# EAGLE design I2C16RJ45 (EAGLE 9.5.0)

## Sheet 1 of 2
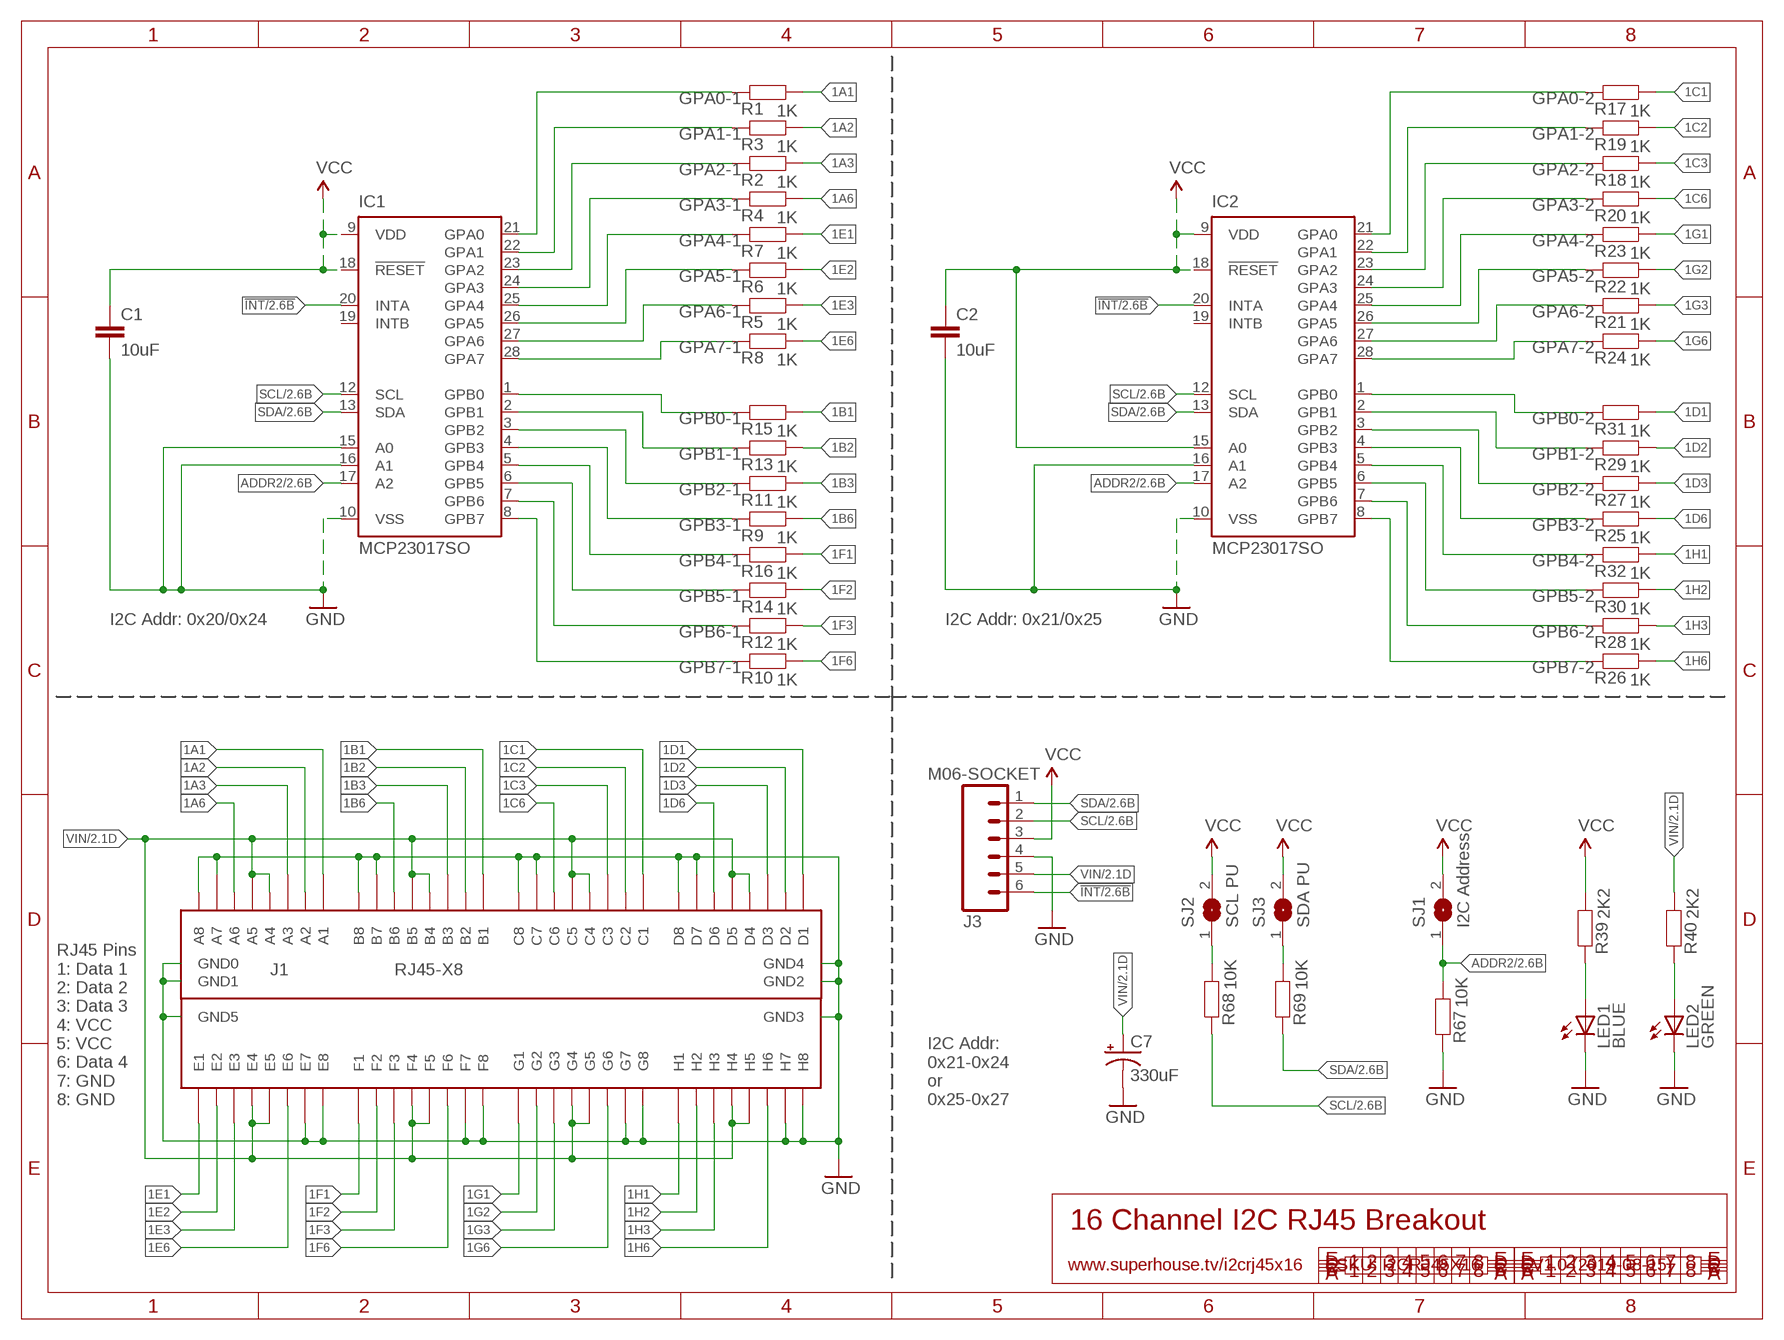
[diagram p0: schematic, sheet 1]

### Parts
C1  10uF  CAP0805  [C0805]
C2  10uF  CAP0805  [C0805]
C7  330uF  CAP_POLG  [PANASONIC_G]
IC1  MCP23017SO  [SO28W]
IC2  MCP23017SO  [SO28W]
J1  RJ45-X8  [RJ45-2X4]
J3  M06-SOCKET  [1X06-S]
LED1  BLUE  LED0603  [LED-0603]
LED2  GREEN  LED0603  [LED-0603]
R1  1K  RESISTOR0603  [R0603]
R2  1K  RESISTOR0603  [R0603]
R3  1K  RESISTOR0603  [R0603]
R4  1K  RESISTOR0603  [R0603]
R5  1K  RESISTOR0603  [R0603]
R6  1K  RESISTOR0603  [R0603]
R7  1K  RESISTOR0603  [R0603]
R8  1K  RESISTOR0603  [R0603]
R9  1K  RESISTOR0603  [R0603]
R10  1K  RESISTOR0603  [R0603]
R11  1K  RESISTOR0603  [R0603]
R12  1K  RESISTOR0603  [R0603]
R13  1K  RESISTOR0603  [R0603]
R14  1K  RESISTOR0603  [R0603]
R15  1K  RESISTOR0603  [R0603]
R16  1K  RESISTOR0603  [R0603]
R17  1K  RESISTOR0603  [R0603]
R18  1K  RESISTOR0603  [R0603]
R19  1K  RESISTOR0603  [R0603]
R20  1K  RESISTOR0603  [R0603]
R21  1K  RESISTOR0603  [R0603]
R22  1K  RESISTOR0603  [R0603]
R23  1K  RESISTOR0603  [R0603]
R24  1K  RESISTOR0603  [R0603]
R25  1K  RESISTOR0603  [R0603]
R26  1K  RESISTOR0603  [R0603]
R27  1K  RESISTOR0603  [R0603]
R28  1K  RESISTOR0603  [R0603]
R29  1K  RESISTOR0603  [R0603]
R30  1K  RESISTOR0603  [R0603]
R31  1K  RESISTOR0603  [R0603]
R32  1K  RESISTOR0603  [R0603]
R39  2K2  RESISTOR0603  [R0603]
R40  2K2  RESISTOR0603  [R0603]
R67  10K  RESISTOR0603  [R0603]
R68  10K  RESISTOR0603  [R0603]
R69  10K  RESISTOR0603  [R0603]
SJ1  I2C Address  SJ-NORMAL  [SJ]
SJ2  SCL PU  SJ-NORMAL  [SJ]
SJ3  SDA PU  SJ-NORMAL  [SJ]

### Nets
1A1: J1.A1 R1.2
1A2: J1.A2 R3.2
1A3: J1.A3 R2.2
1A6: J1.A6 R4.2
1B1: J1.B1 R15.2
1B2: J1.B2 R13.2
1B3: J1.B3 R11.2
1B6: J1.B6 R9.2
1C1: J1.C1 R17.2
1C2: J1.C2 R19.2
1C3: J1.C3 R18.2
1C6: J1.C6 R20.2
1D1: J1.D1 R31.2
1D2: J1.D2 R29.2
1D3: J1.D3 R27.2
1D6: J1.D6 R25.2
1E1: J1.E1 R7.2
1E2: J1.E2 R6.2
1E3: J1.E3 R5.2
1E6: J1.E6 R8.2
1F1: J1.F1 R16.2
1F2: J1.F2 R14.2
1F3: J1.F3 R12.2
1F6: J1.F6 R10.2
1G1: J1.G1 R23.2
1G2: J1.G2 R22.2
1G3: J1.G3 R21.2
1G6: J1.G6 R24.2
1H1: J1.H1 R32.2
1H2: J1.H2 R30.2
1H3: J1.H3 R28.2
1H6: J1.H6 R26.2
!INT: IC1.20(INTA) IC2.20(INTA) J3.6 ; also sheet 2
ADDR2: IC1.17(A2) IC2.17(A2) R67.2 SJ1.1 ; also sheet 2
GND: C1.2 C2.2 C7.- IC1.10(VSS) IC1.15(A0) IC1.16(A1) IC2.10(VSS) IC2.16(A1) J1.A7 J1.A8 J1.B7 J1.B8 J1.C7 J1.C8 J1.D7 J1.D8 J1.E7 J1.E8 J1.F7 J1.F8 J1.G7 J1.G8 J1.GND0 J1.GND1 J1.GND2 J1.GND3 J1.GND4 J1.GND5 J1.H7 J1.H8 J3.4 LED1.C LED2.C R67.1 ; also sheet 2
GPA0-1: IC1.21(GPA0) R1.1
GPA0-2: IC2.21(GPA0) R17.1
GPA1-1: IC1.22(GPA1) R3.1
GPA1-2: IC2.22(GPA1) R19.1
GPA2-1: IC1.23(GPA2) R2.1
GPA2-2: IC2.23(GPA2) R18.1
GPA3-1: IC1.24(GPA3) R4.1
GPA3-2: IC2.24(GPA3) R20.1
GPA4-1: IC1.25(GPA4) R7.1
GPA4-2: IC2.25(GPA4) R23.1
GPA5-1: IC1.26(GPA5) R6.1
GPA5-2: IC2.26(GPA5) R22.1
GPA6-1: IC1.27(GPA6) R5.1
GPA6-2: IC2.27(GPA6) R21.1
GPA7-1: IC1.28(GPA7) R8.1
GPA7-2: IC2.28(GPA7) R24.1
GPB0-1: IC1.1(GPB0) R15.1
GPB0-2: IC2.1(GPB0) R31.1
GPB1-1: IC1.2(GPB1) R13.1
GPB1-2: IC2.2(GPB1) R29.1
GPB2-1: IC1.3(GPB2) R11.1
GPB2-2: IC2.3(GPB2) R27.1
GPB3-1: IC1.4(GPB3) R9.1
GPB3-2: IC2.4(GPB3) R25.1
GPB4-1: IC1.5(GPB4) R16.1
GPB4-2: IC2.5(GPB4) R32.1
GPB5-1: IC1.6(GPB5) R14.1
GPB5-2: IC2.6(GPB5) R30.1
GPB6-1: IC1.7(GPB6) R12.1
GPB6-2: IC2.7(GPB6) R28.1
GPB7-1: IC1.8(GPB7) R10.1
GPB7-2: IC2.8(GPB7) R26.1
N$1: R68.2 SJ2.1
N$2: R69.2 SJ3.1
N$7: LED1.A R39.1
N$8: LED2.A R40.1
SCL: IC1.12(SCL) IC2.12(SCL) J3.2 R68.1 ; also sheet 2
SDA: IC1.13(SDA) IC2.13(SDA) J3.1 R69.1 ; also sheet 2
VCC: C1.1 C2.1 IC1.9(VDD) IC1.18(!RESET) IC2.9(VDD) IC2.15(A0) IC2.18(!RESET) J3.3 R39.2 SJ1.2 SJ2.2 SJ3.2 ; also sheet 2
VIN: C7.+ J1.A4 J1.A5 J1.B4 J1.B5 J1.C4 J1.C5 J1.D4 J1.D5 J1.E4 J1.E5 J1.F4 J1.F5 J1.G4 J1.G5 J1.H4 J1.H5 J3.5 R40.2 ; also sheet 2
Unconnected: IC1.19(INTB) IC2.19(INTB)

### Notes on the sheet
- I2C Addr: 0x20/0x24 | I2C Addr: 0x21/0x25
- RJ45 Pins
  1: Data 1
  2: Data 2
  3: Data 3
  4: VCC
  5: VCC
  6: Data 4
  7: GND
  8: GND
- I2C Addr:
  0x21-0x24
  or
  0x25-0x27
- 16 Channel I2C RJ45 Breakout
- www.superhouse.tv/i2crj45x16 | SKU: I2CRJ45X16 | V1.0 (2019-08-15)

## Sheet 2 of 2
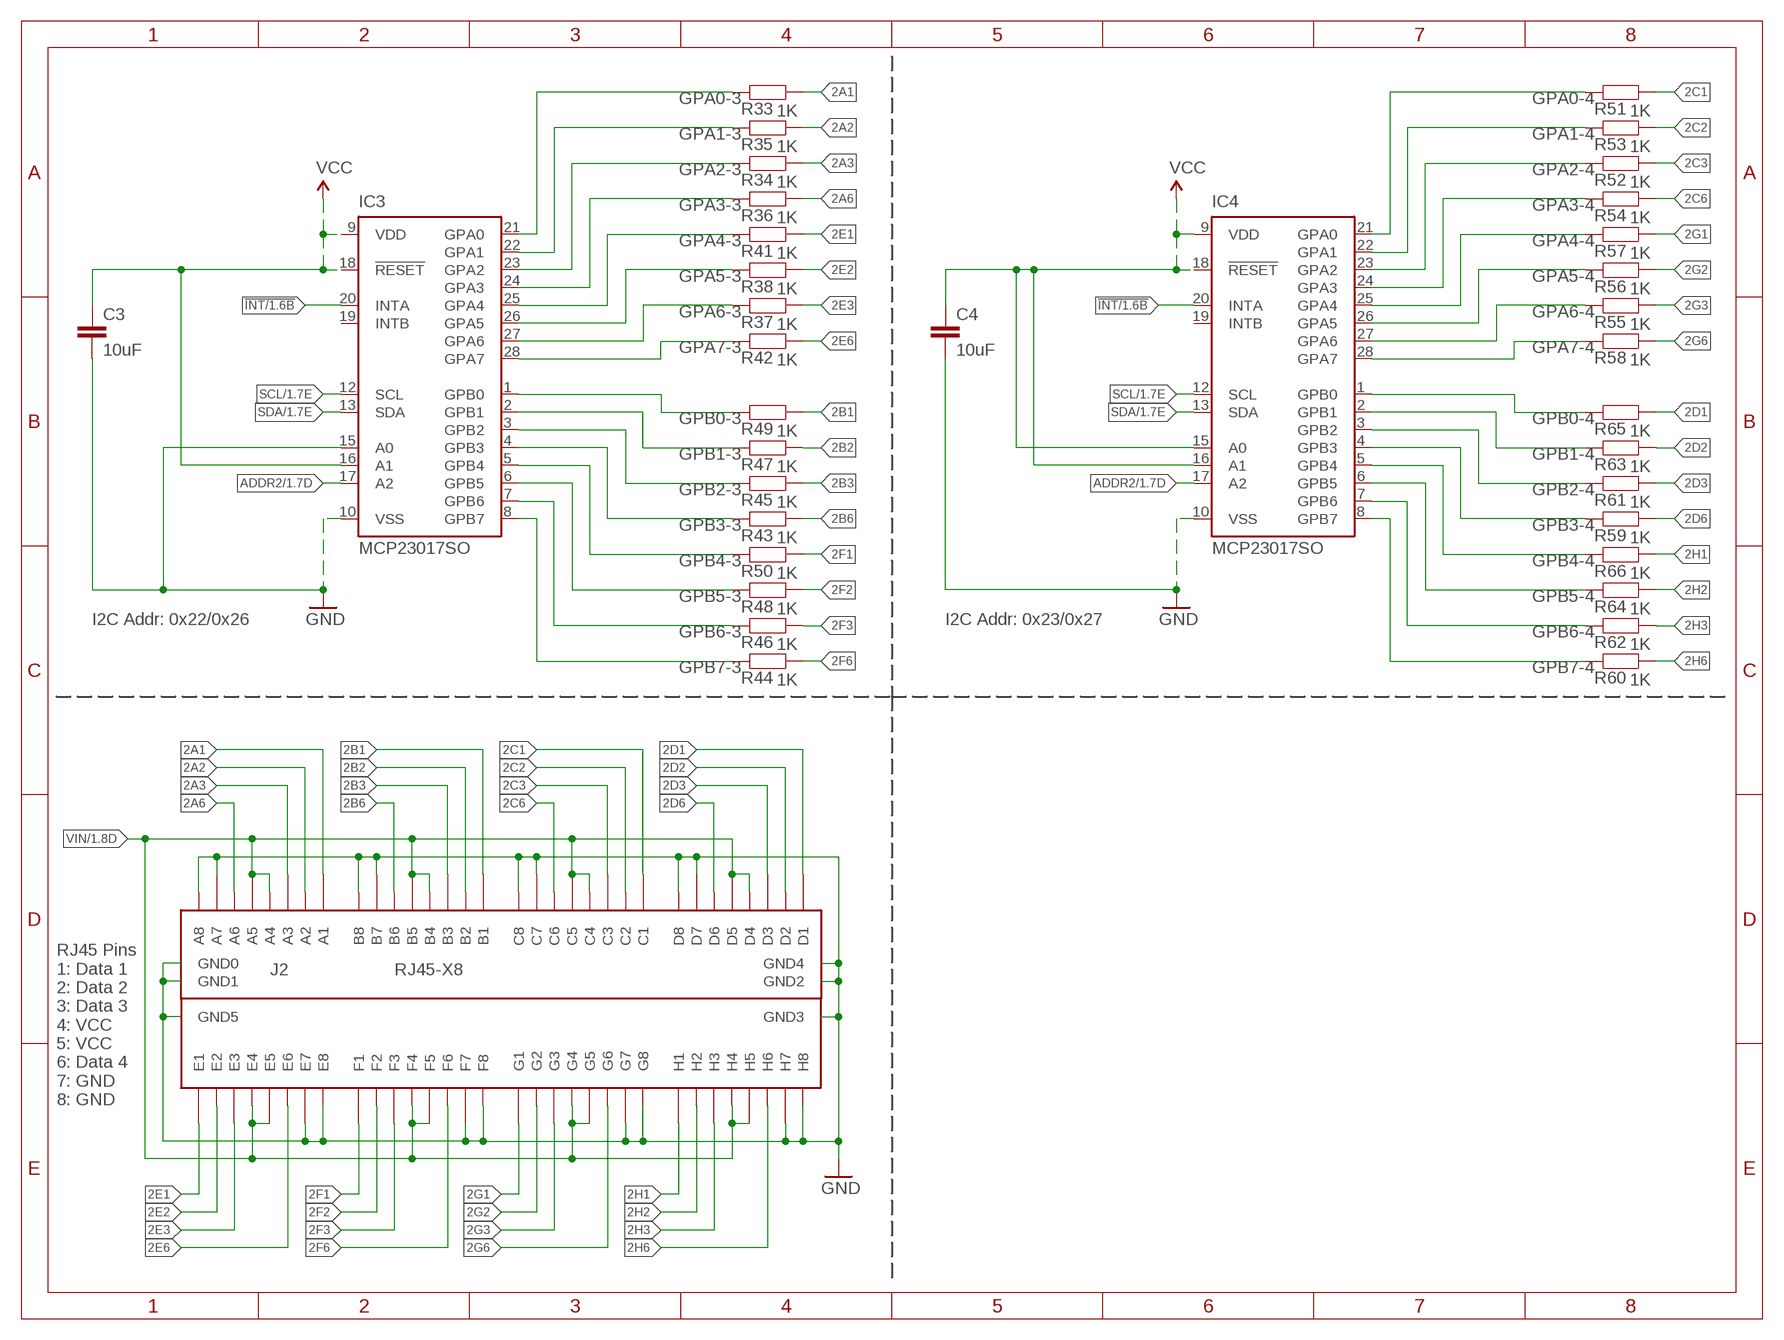
[diagram p1: schematic, sheet 2]

### Parts
C3  10uF  CAP0805  [C0805]
C4  10uF  CAP0805  [C0805]
IC3  MCP23017SO  [SO28W]
IC4  MCP23017SO  [SO28W]
J2  RJ45-X8  [RJ45-2X4]
R33  1K  RESISTOR0603  [R0603]
R34  1K  RESISTOR0603  [R0603]
R35  1K  RESISTOR0603  [R0603]
R36  1K  RESISTOR0603  [R0603]
R37  1K  RESISTOR0603  [R0603]
R38  1K  RESISTOR0603  [R0603]
R41  1K  RESISTOR0603  [R0603]
R42  1K  RESISTOR0603  [R0603]
R43  1K  RESISTOR0603  [R0603]
R44  1K  RESISTOR0603  [R0603]
R45  1K  RESISTOR0603  [R0603]
R46  1K  RESISTOR0603  [R0603]
R47  1K  RESISTOR0603  [R0603]
R48  1K  RESISTOR0603  [R0603]
R49  1K  RESISTOR0603  [R0603]
R50  1K  RESISTOR0603  [R0603]
R51  1K  RESISTOR0603  [R0603]
R52  1K  RESISTOR0603  [R0603]
R53  1K  RESISTOR0603  [R0603]
R54  1K  RESISTOR0603  [R0603]
R55  1K  RESISTOR0603  [R0603]
R56  1K  RESISTOR0603  [R0603]
R57  1K  RESISTOR0603  [R0603]
R58  1K  RESISTOR0603  [R0603]
R59  1K  RESISTOR0603  [R0603]
R60  1K  RESISTOR0603  [R0603]
R61  1K  RESISTOR0603  [R0603]
R62  1K  RESISTOR0603  [R0603]
R63  1K  RESISTOR0603  [R0603]
R64  1K  RESISTOR0603  [R0603]
R65  1K  RESISTOR0603  [R0603]
R66  1K  RESISTOR0603  [R0603]

### Nets
2A1: J2.A1 R33.2
2A2: J2.A2 R35.2
2A3: J2.A3 R34.2
2A6: J2.A6 R36.2
2B1: J2.B1 R49.2
2B2: J2.B2 R47.2
2B3: J2.B3 R45.2
2B6: J2.B6 R43.2
2C1: J2.C1 R51.2
2C2: J2.C2 R53.2
2C3: J2.C3 R52.2
2C6: J2.C6 R54.2
2D1: J2.D1 R65.2
2D2: J2.D2 R63.2
2D3: J2.D3 R61.2
2D6: J2.D6 R59.2
2E1: J2.E1 R41.2
2E2: J2.E2 R38.2
2E3: J2.E3 R37.2
2E6: J2.E6 R42.2
2F1: J2.F1 R50.2
2F2: J2.F2 R48.2
2F3: J2.F3 R46.2
2F6: J2.F6 R44.2
2G1: J2.G1 R57.2
2G2: J2.G2 R56.2
2G3: J2.G3 R55.2
2G6: J2.G6 R58.2
2H1: J2.H1 R66.2
2H2: J2.H2 R64.2
2H3: J2.H3 R62.2
2H6: J2.H6 R60.2
!INT: IC3.20(INTA) IC4.20(INTA) ; also sheet 1
ADDR2: IC3.17(A2) IC4.17(A2) ; also sheet 1
GND: C3.2 C4.2 IC3.10(VSS) IC3.15(A0) IC4.10(VSS) J2.A7 J2.A8 J2.B7 J2.B8 J2.C7 J2.C8 J2.D7 J2.D8 J2.E7 J2.E8 J2.F7 J2.F8 J2.G7 J2.G8 J2.GND0 J2.GND1 J2.GND2 J2.GND3 J2.GND4 J2.GND5 J2.H7 J2.H8 ; also sheet 1
GPA0-3: IC3.21(GPA0) R33.1
GPA0-4: IC4.21(GPA0) R51.1
GPA1-3: IC3.22(GPA1) R35.1
GPA1-4: IC4.22(GPA1) R53.1
GPA2-3: IC3.23(GPA2) R34.1
GPA2-4: IC4.23(GPA2) R52.1
GPA3-3: IC3.24(GPA3) R36.1
GPA3-4: IC4.24(GPA3) R54.1
GPA4-3: IC3.25(GPA4) R41.1
GPA4-4: IC4.25(GPA4) R57.1
GPA5-3: IC3.26(GPA5) R38.1
GPA5-4: IC4.26(GPA5) R56.1
GPA6-3: IC3.27(GPA6) R37.1
GPA6-4: IC4.27(GPA6) R55.1
GPA7-3: IC3.28(GPA7) R42.1
GPA7-4: IC4.28(GPA7) R58.1
GPB0-3: IC3.1(GPB0) R49.1
GPB0-4: IC4.1(GPB0) R65.1
GPB1-3: IC3.2(GPB1) R47.1
GPB1-4: IC4.2(GPB1) R63.1
GPB2-3: IC3.3(GPB2) R45.1
GPB2-4: IC4.3(GPB2) R61.1
GPB3-3: IC3.4(GPB3) R43.1
GPB3-4: IC4.4(GPB3) R59.1
GPB4-3: IC3.5(GPB4) R50.1
GPB4-4: IC4.5(GPB4) R66.1
GPB5-3: IC3.6(GPB5) R48.1
GPB5-4: IC4.6(GPB5) R64.1
GPB6-3: IC3.7(GPB6) R46.1
GPB6-4: IC4.7(GPB6) R62.1
GPB7-3: IC3.8(GPB7) R44.1
GPB7-4: IC4.8(GPB7) R60.1
SCL: IC3.12(SCL) IC4.12(SCL) ; also sheet 1
SDA: IC3.13(SDA) IC4.13(SDA) ; also sheet 1
VCC: C3.1 C4.1 IC3.9(VDD) IC3.16(A1) IC3.18(!RESET) IC4.9(VDD) IC4.15(A0) IC4.16(A1) IC4.18(!RESET) ; also sheet 1
VIN: J2.A4 J2.A5 J2.B4 J2.B5 J2.C4 J2.C5 J2.D4 J2.D5 J2.E4 J2.E5 J2.F4 J2.F5 J2.G4 J2.G5 J2.H4 J2.H5 ; also sheet 1
Unconnected: IC3.19(INTB) IC4.19(INTB)

### Notes on the sheet
- I2C Addr: 0x22/0x26 | I2C Addr: 0x23/0x27
- RJ45 Pins
  1: Data 1
  2: Data 2
  3: Data 3
  4: VCC
  5: VCC
  6: Data 4
  7: GND
  8: GND

## Library data of the parts
C1-C4 = SuperHouse-DiscreteSemi:CAP: Capacitor Standard ceramic capacitor
C7 = SuperHouse-DiscreteSemi:CAP_POL: Capacitor Polarized These are standard SMD and PTH capacitors. Normally 10uF, 47uF, and 100uF in electrolytic and tantalum varieties. Always verify the external diameter of the through hole cap, it varies with capacity, voltage, and manufacturer. The EIA devices should be standard.
IC1-IC4 = SuperHouse-ICs:MCP23017: http://ww1.microchip.com/downloads/en/DeviceDoc/21952a.pdf Source: http://ww1.microchip.com/downloads/en/DeviceDoc/21952a.pdf
J1 J2 = SuperHouse-Connectors:RJ45-X8: 8-way RJ45 socket, PCB mount. 2 rows of 4.
J3 = SuperHouse-Connectors:M06: 6-way header Standard 1x6 header, and screw terminal variations
LED1 LED2 = SuperHouse-LEDs:LED: LEDs Standard schematic elements and footprints for 5mm, 3mm, 1206, and 0603 sized LEDs. 5mm - Spark Fun Electronics SKU : COM-00529 (and others)
R1-R69 = SuperHouse-DiscreteSemi:RESISTOR: Resistor Standard resistors.
SJ1-SJ3 = SuperHouse-Jumpers:SJ: SMD solder jumper, normally-open. Add solder to close the connection.

## Board
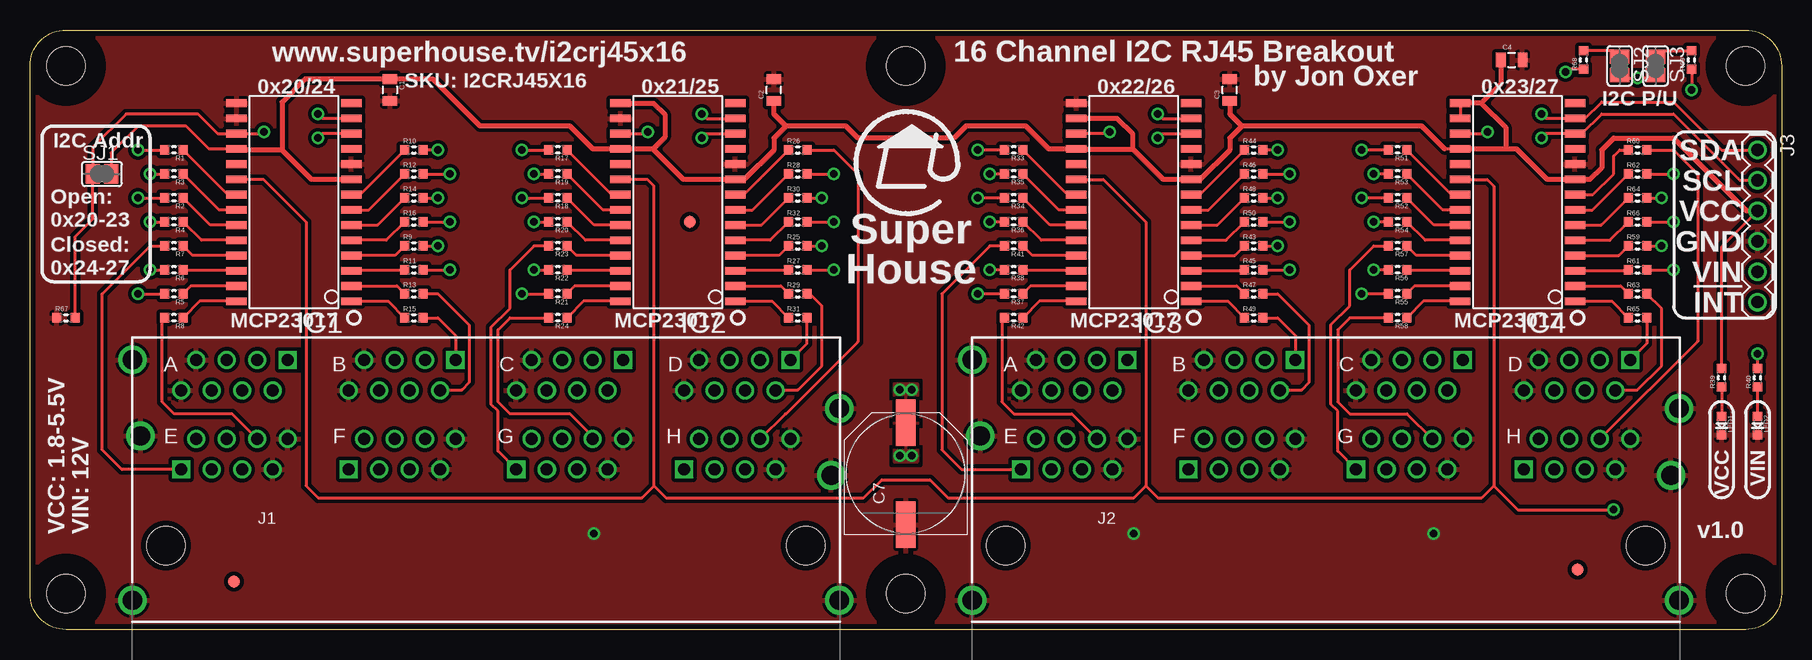
[diagram p2: board, top side]
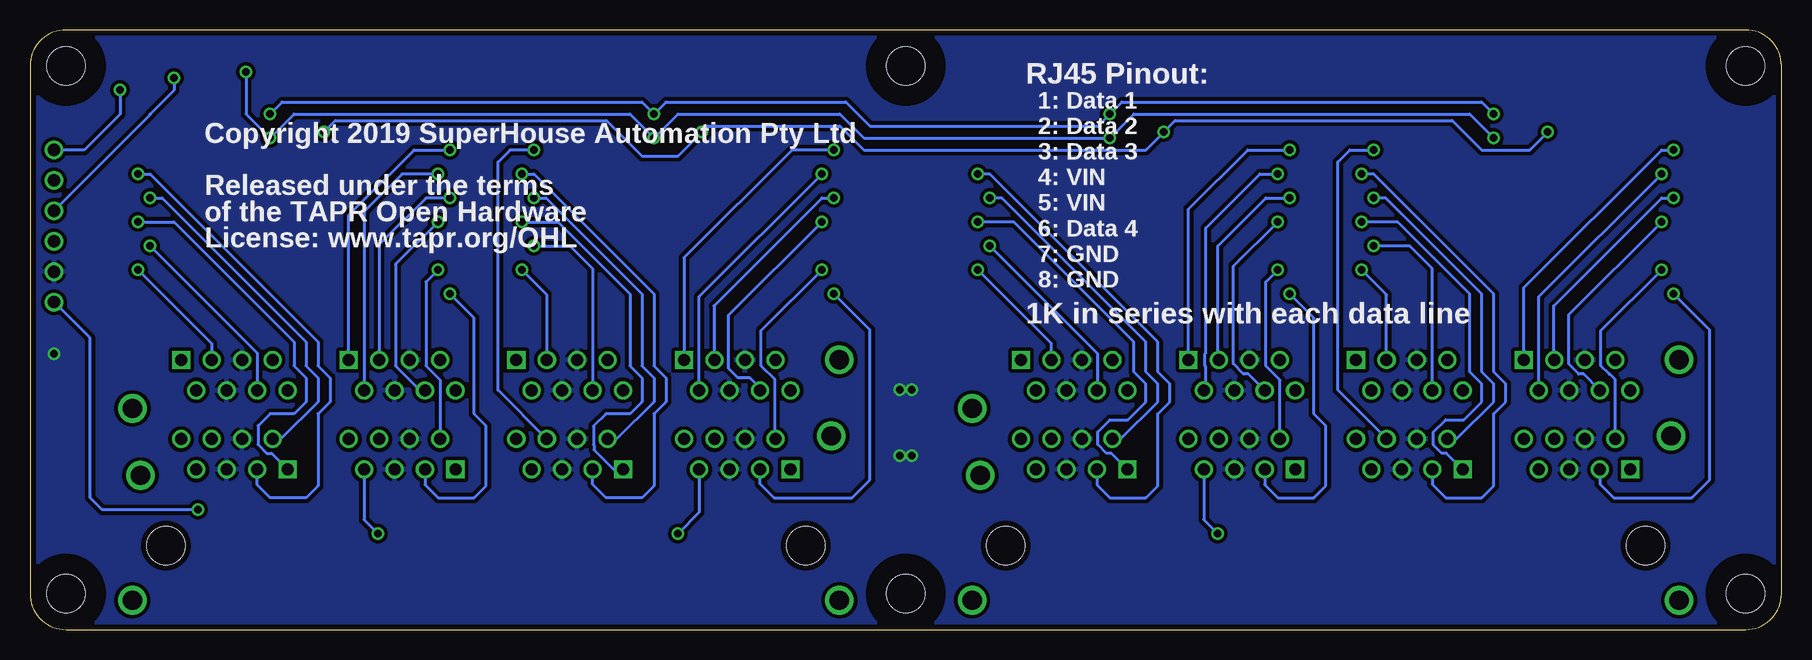
[diagram p3: board, bottom side, seen from below]

Size 146 x 50 mm. Coordinates in mm from the lower left corner, seen from the top.
Outline: 3,0 arc-90 0,3 0,47 arc-90 3,50 143,50 arc-90 146,47 146,3 arc-90 143,0 3,0
Copper layers (1*16): Top 0.035mm / dielectric 1.5mm / Bottom 0.035mm
Design rules "default *": minimum track width 10mil, minimum drill 24mil, track to track 12mil, track to pad 12mil, pad to pad 12mil, via to via 12mil, smd to smd 8mil, copper to edge 18mil, drill to drill 8mil, minimum pad ring 10mil, minimum via ring 8mil, stop-mask expansion 4mil, vias tented up to drill 0mil, thermal gap 10mil
Holes 3.2 mm at 3,3 143,3 143,47 3,47 73,3 73,47
tRestrict: area -0.2,43.8 to 6.2,50.2; area -0.2,-0.2 to 6.2,6.2; area 69.8,-0.2 to 76.2,6.2; area 139.8,-0.2 to 146.2,6.2; area 139.8,43.8 to 146.2,50.2; area 69.8,43.8 to 76.2,50.2
bRestrict: area -0.2,43.8 to 6.2,50.2; area 69.8,43.8 to 76.2,50.2; area 139.8,43.8 to 146.2,50.2; area 69.8,-0.2 to 76.2,6.2; area 139.8,-0.2 to 146.2,6.2; area -0.2,-0.2 to 6.2,6.2

### Footprints (pad centres in the part's own frame; a part is rotated, then mirrored left to right if it is on the bottom)
C0805 = smd 0.8 x 1.2: 1 -0.9,0; 2 0.9,0
PANASONIC_G = smd 3.9 x 1.6: + 4.25,0; - -4.25,0
FIDUCIAL-1X2.5 = smd 1 x 1: 1 0,0
SO28W = smd 0.65 x 1.7: 1 -7.62,-4.78; 2 -6.35,-4.78; 3 -5.08,-4.78; 4 -3.81,-4.78; 5 -2.54,-4.78; 6 -1.27,-4.78; 7 0,-4.78; 8 1.27,-4.78; 9 2.54,-4.78; 10 3.81,-4.78; 11 5.08,-4.78; 12 6.35,-4.78; 13 7.62,-4.78; 14 8.89,-4.78; 15 8.89,4.78; 16 7.62,4.78; 17 6.35,4.78; 18 5.08,4.78; 19 3.81,4.78; 20 2.54,4.78; 21 1.27,4.78; 22 0,4.78; 23 -1.27,4.78; 24 -2.54,4.78; 25 -3.81,4.78; 26 -5.08,4.78; 27 -6.35,4.78; 28 -7.62,4.78
RJ45-2X4 = drill 1 square: A1 -16.51,15.49; B1 -2.54,15.49; C1 11.43,15.49; D1 25.4,15.49; E1 -25.4,6.35; F1 -11.43,6.35; G1 2.54,6.35; H1 16.51,6.35 | drill 1: A2 -17.78,12.95; A3 -19.05,15.49; A4 -20.32,12.95; A5 -21.59,15.49; A6 -22.86,12.95; A7 -24.13,15.49; A8 -25.4,12.95; B2 -3.81,12.95; B3 -5.08,15.49; B4 -6.35,12.95; B5 -7.62,15.49; B6 -8.89,12.95; B7 -10.16,15.49; B8 -11.43,12.95; C2 10.16,12.95; C3 8.89,15.49; C4 7.62,12.95; C5 6.35,15.49; C6 5.08,12.95; C7 3.81,15.49; C8 2.54,12.95; D2 24.13,12.95; D3 22.86,15.49; D4 21.59,12.95; D5 20.32,15.49; D6 19.05,12.95; D7 17.78,15.49; D8 16.51,12.95; E2 -24.13,8.89; E3 -22.86,6.35; E4 -21.59,8.89; E5 -20.32,6.35; E6 -19.05,8.89; E7 -17.78,6.35; E8 -16.51,8.89; F2 -10.16,8.89; F3 -8.89,6.35; F4 -7.62,8.89; F5 -6.35,6.35; F6 -5.08,8.89; F7 -3.81,6.35; F8 -2.54,8.89; G2 3.81,8.89; G3 5.08,6.35; G4 6.35,8.89; G5 7.62,6.35; G6 8.89,8.89; G7 10.16,6.35; G8 11.43,8.89; H2 17.78,8.89; H3 19.05,6.35; H4 20.32,8.89; H5 21.59,6.35; H6 22.86,8.89; H7 24.13,6.35; H8 25.4,8.89 | drill 1.6: GND0 29.464,-4.572; GND1 28.79,5.85; GND2 -29.46,15.5; GND3 -28.79,9.15; GND4 -29.464,-4.572; GND5 29.46,11.43 | hole 3.2: 26.67,0; -26.67,0
1X06-S = drill 1.016: 1 0,0; 2 2.54,0; 3 5.08,0; 4 7.62,0; 5 10.16,0; 6 12.7,0
LED-0603 = smd 0.762 x 0.762: A -0.762,0; C 0.762,0
R0603 = smd 0.762 x 0.762: 1 -0.762,0; 2 0.762,0
SJ = smd 1.168 x 1.6: 1 -0.762,0; 2 0.762,0

### Placement (x,y rotation side)
C1  30,45 270 top
C2  62,45 90 top
C3  100,45 90 top
C4  123.5,47.5 0 top
C7  73,13 90 top
FID1  FIDUCIAL1X2.5  [FIDUCIAL-1X2.5]  129,5 0 top
FID2  FIDUCIAL1X2.5  [FIDUCIAL-1X2.5]  17,4 0 top
FID3  FIDUCIAL1X2.5  [FIDUCIAL-1X2.5]  55,34 0 top
IC1  22,35 90 top
IC2  54,35 90 top
IC3  92,35 90 top
IC4  124,35 90 top
J1  38,7 0 top
J2  108,7 0 top
J3  144,40 270 top
LED1  141,17 270 top
LED2  144,17 270 top
R1  12,40 180 top
R2  12,36 180 top
R3  12,38 180 top
R4  12,34 180 top
R5  12,28 180 top
R6  12,30 180 top
R7  12,32 180 top
R8  12,26 180 top
R9  32,32 0 top
R10  32,40 0 top
R11  32,30 0 top
R12  32,38 0 top
R13  32,28 0 top
R14  32,36 0 top
R15  32,26 0 top
R16  32,34 0 top
R17  44,40 180 top
R18  44,36 180 top
R19  44,38 180 top
R20  44,34 180 top
R21  44,28 180 top
R22  44,30 180 top
R23  44,32 180 top
R24  44,26 180 top
R25  64,32 0 top
R26  64,40 0 top
R27  64,30 0 top
R28  64,38 0 top
R29  64,28 0 top
R30  64,36 0 top
R31  64,26 0 top
R32  64,34 0 top
R33  82,40 180 top
R34  82,36 180 top
R35  82,38 180 top
R36  82,34 180 top
R37  82,28 180 top
R38  82,30 180 top
R39  141,21 90 top
R40  144,21 90 top
R41  82,32 180 top
R42  82,26 180 top
R43  102,32 0 top
R44  102,40 0 top
R45  102,30 0 top
R46  102,38 0 top
R47  102,28 0 top
R48  102,36 0 top
R49  102,26 0 top
R50  102,34 0 top
R51  114,40 180 top
R52  114,36 180 top
R53  114,38 180 top
R54  114,34 180 top
R55  114,28 180 top
R56  114,30 180 top
R57  114,32 180 top
R58  114,26 180 top
R59  134,32 0 top
R60  134,40 0 top
R61  134,30 0 top
R62  134,38 0 top
R63  134,28 0 top
R64  134,36 0 top
R65  134,26 0 top
R66  134,34 0 top
R67  3,26 0 top
R68  129.5,47.5 90 top
R69  138.5,47.5 90 top
SJ1  6,38 0 top
SJ2  132.5,47 270 top
SJ3  135.5,47 270 top

### Tracks (layer width: path | path; a pad name or v marks a point on that pad's centre or on a via)
1A1  (via drill 0.61)
  Top 0.254: v9,40 R1.2
  Bottom 0.254: J1.A1 21.49,28.51 10,40 v9,40
1A2  (via drill 0.61)
  Top 0.254: v10,38 R3.2
  Bottom 0.254: J1.A2 20.22,27.78 v10,38
1A3  (via drill 0.61)
  Top 0.254: v9,36 R2.2
  Bottom 0.254: J1.A3 19,22.54 19,27 10,36 v9,36
1A6  (via drill 0.61)
  Top 0.254: v10,34 R4.2
  Bottom 0.254: J1.A6 16.49,21.3 16.9,21.3 17.76,22.17 17.76,26.24 v10,34
1B1
  Top 0.254: R15.2 34,26 35.46,24.54 J1.B1
1B2
  Top 0.254: J1.B2 34.24,20 36,20 36.65,20.65 36.65,25.35 34,28 R13.2
1B3  (via drill 0.61)
  Top 0.254: R11.2 v35,30
  Bottom 0.254: J1.B3 32.92,27.92 v35,30
1B6  (via drill 0.61)
  Top 0.254: R9.2 v34,32
  Bottom 0.254: J1.B6 29.11,30.11 31,32 v34,32
1C1  (via drill 0.61)
  Top 0.254: v41,40 R17.2
  Bottom 0.254: J1.C1 49.43,35.07 44.5,40 v41,40
1C2  (via drill 0.61)
  Top 0.254: v42,38 R19.2
  Bottom 0.254: J1.C2 48,20.11 48,21.92 48.08,22 48.08,22.98 48,23.06 48,33.5 43.5,38 v42,38
1C3  (via drill 0.61)
  Top 0.254: v41,36 R18.2
  Bottom 0.254: J1.C3 47,22.6 47,32 43,36 v41,36
1C6  (via drill 0.61)
  Top 0.254: v42,34 R20.2
  Bottom 0.254: J1.C6 44.43,21.3 44.84,21.3 45.7,22.17 45.7,30.3 v42,34
1D1
  Top 0.254: J1.D1 64.76,23.85 R31.2
1D2
  Top 0.254: J1.D2 62.18,20 64,20 66,22 66,27 65,28 R29.2
1D3  (via drill 0.61)
  Top 0.254: R27.2 v67,30
  Bottom 0.254: J1.D3 60.86,23.86 v67,30
1D6  (via drill 0.61)
  Top 0.254: R25.2 v66,32
  Bottom 0.254: J1.D6 57,20 57,23 v66,32
1E1
  Top 0.254: J1.E1 7.65,13.35 6,15 6,28 10,32 R7.2
1E2  (via drill 0.61)
  Top 0.254: v10,30 R6.2
  Bottom 0.254: J1.E2 13.87,20.87 14.3,21.3 14.36,21.3 15.06,22 15.06,24.94 v10,30
1E3  (via drill 0.61)
  Top 0.254: v9,28 R5.2
  Bottom 0.254: J1.E3 15.14,12.14 14,11 7.5,11 6,12.5 6,25 v9,28
1E6
  Top 0.254: J1.E6 16.84,18 12,18 11,19 11,25.76 R8.2
1F1  (via drill 0.61)
  Top 0.254: R16.2 v35,34
  Bottom 0.254: J1.F1 27.92,14.7 28.33,14.7 29.03,15.4 29.03,16.47 28,17.5 26.5,17.5 25,19 25,20.5 26,21.5 26,28 32,34 v35,34
1F2  (via drill 0.61)
  Top 0.254: R14.2 v34,36
  Bottom 0.254: J1.F2 27.11,15.89 24,19 24,20.5 25,21.5 25,28 33,36 v34,36
1F3  (via drill 0.61)
  Top 0.254: R12.2 v35,38
  Bottom 0.254: J1.F3 29.11,12.11 28,11 25,11 24,12 24,18 23,19 23,20.5 24,21.5 24,28 34,38 v35,38
1F6  (via drill 0.61)
  Top 0.254: v34,40 R10.2
  Bottom 0.254: J1.F6 32.92,15.92 37,20 37,39 36,40 v34,40
1G1
  Top 0.254: R23.2 42,32 40,30 40,26.79 38.44,25.23 38.44,18.77 39,18.21 39,14.89 J1.G1
1G2  (via drill 0.61)
  Top 0.254: v42,30 R22.2
  Bottom 0.254: J1.G2 41.81,20.81 43,22 43,29 v42,30
1G3  (via drill 0.61)
  Top 0.254: v41,28 R21.2
  Bottom 0.254: J1.G3 43.08,12.08 42,11 39,11 38,12 38,17 39,18 39,26 v41,28
1G6
  Top 0.254: J1.G6 46.89,16.11 45,18 40,18 39,19 39,25 40,26 R24.2
1H1  (via drill 0.61)
  Top 0.254: R32.2 v67,34
  Bottom 0.254: J1.H1 55.86,14.7 56.27,14.7 57,15.43 57,16.5 56,17.5 54.5,17.5 53,19 53,20.5 54,21.5 54,24 64,34 v67,34
1H2  (via drill 0.61)
  Top 0.254: R30.2 v66,36
  Bottom 0.254: J1.H2 55.11,15.89 52,19 52,20.5 53,21.5 53,24 65,36 v66,36
1H3  (via drill 0.61)
  Top 0.254: R28.2 v67,38
  Bottom 0.254: J1.H3 57.05,12.05 56,11 53,11 52,12 52,18 51,19 51,20.5 52,21.5 52,24 66,38 v67,38
1H6
  Top 0.254: J1.H6 62.97,18 63,18 69,24 69,38 67,40 R26.2
2A1  (via drill 0.61)
  Top 0.254: R33.2 v79,40
  Bottom 0.254: v79,40 82.5,40 91.49,31.01 J2.A1
2A2  (via drill 0.61)
  Top 0.254: R35.2 v80,38
  Bottom 0.254: J2.A2 90.22,27.78 v80,38
2A3  (via drill 0.61)
  Top 0.254: R34.2 v79,36
  Bottom 0.254: J2.A3 88.95,26.95 89,27 80,36 v79,36
2A6  (via drill 0.61)
  Top 0.254: R36.2 v80,34
  Bottom 0.254: J2.A6 85.14,20.14 86,21 87,21 87.76,21.76 87.76,26.24 v80,34
2B1
  Top 0.254: R49.2 104,26 105.46,24.54 J2.B1
2B2
  Top 0.254: J2.B2 104.24,20 106,20 106.65,20.65 106.65,25.35 104,28 R47.2
2B3  (via drill 0.61)
  Top 0.254: R45.2 v105,30
  Bottom 0.254: v105,30 102.92,27.92 J2.B3
2B6  (via drill 0.61)
  Top 0.254: R43.2 v104,32
  Bottom 0.254: v104,32 101,32 99.11,30.11 J2.B6
2C1  (via drill 0.61)
  Top 0.254: R51.2 v111,40
  Bottom 0.254: J2.C1 119.43,34.57 114,40 v111,40
2C2  (via drill 0.61)
  Top 0.254: R53.2 v112,38
  Bottom 0.254: v112,38 115,38 118.16,34.84 J2.C2
2C3  (via drill 0.61)
  Top 0.254: R52.2 v111,36
  Bottom 0.254: v111,36 113,36 116.89,32.11 J2.C3
2C6  (via drill 0.61)
  Top 0.254: R54.2 v112,34
  Bottom 0.254: J2.C6 113.49,19.95 115.54,22 115.54,30.46 v112,34
2D1
  Top 0.254: R65.2 134.76,23.85 J2.D1
2D2
  Top 0.254: J2.D2 133.95,19.95 136,22 136,26.76 R63.2
2D3  (via drill 0.61)
  Top 0.254: R61.2 v137,30
  Bottom 0.254: v137,30 130.86,23.86 J2.D3
2D6  (via drill 0.61)
  Top 0.254: R59.2 v136,32
  Bottom 0.254: v136,32 127.05,23.05 J2.D6
2E1
  Top 0.254: R41.2 80,32 76,28 76,15 77.65,13.35 J2.E1
2E2  (via drill 0.61)
  Top 0.254: R38.2 v80,30
  Bottom 0.254: v80,30 85.06,24.94 85.06,22 83.95,20.9 83.95,15.97 J2.E2
2E3  (via drill 0.61)
  Top 0.254: R37.2 v79,28
  Bottom 0.254: J2.E3 85.14,12.14 84,11 77.5,11 76,12.5 76,25 v79,28
2E6
  Top 0.254: R42.2 81,25.76 81,19 82,18 86.84,18 J2.E6
2F1  (via drill 0.61)
  Top 0.254: R50.2 v105,34
  Bottom 0.254: J2.F1 97.35,13.35 99,15 99,15.37 99.03,15.4 99.03,16.97 98,18 96,18 95,19 95,21 96,22 96,28 102,34 v105,34
2F2  (via drill 0.61)
  Top 0.254: R48.2 v104,36
  Bottom 0.254: v104,36 103,36 95,28 95,22 94,21 94,19 97.11,15.89 J2.F2
2F3  (via drill 0.61)
  Top 0.254: R46.2 v105,38
  Bottom 0.254: v105,38 104,38 94,28 94,22 93,21 93,19 94,18 94,12 95,11 98,11 99.11,12.11 J2.F3
2F6  (via drill 0.61)
  Top 0.254: v104,40 R44.2
  Bottom 0.254: v104,40 106,40 107,39 107,19.97 J2.F6
2G1
  Top 0.254: J2.G1 109,14.89 109,18.21 108.44,18.77 108.44,25.44 110,27 110,30 112,32 R57.2
2G2  (via drill 0.61)
  Top 0.254: R56.2 v112,30
  Bottom 0.254: v112,30 113,29 113,22 111.81,20.81 J2.G2
2G3  (via drill 0.61)
  Top 0.254: R55.2 v111,28
  Bottom 0.254: J2.G3 113.08,12.08 112,11 109,11 108,12 108,17 109,18 109,26 v111,28
2G6
  Top 0.254: R58.2 110,26 109,25 109,19 110,18 114.78,18 J2.G6
2H1  (via drill 0.61)
  Top 0.254: R66.2 v137,34
  Bottom 0.254: v137,34 134,34 124,24 124,22 123,21 123,19 124,18 126,18 127,17 127,15.43 126.27,14.7 125.86,14.7 J2.H1
2H2  (via drill 0.61)
  Top 0.254: R64.2 v136,36
  Bottom 0.254: v136,36 135,36 123,24 123,22 122,21 122,19 125.11,15.89 J2.H2
2H3  (via drill 0.61)
  Top 0.254: R62.2 v137,38
  Bottom 0.254: v137,38 136,38 122,24 122,22 121,21 121,19 122,18 122,12 123,11 126,11 127.05,12.05 J2.H3
2H6
  Top 0.254: R60.2 137,40 139,38 139,24.03 J2.H6
!INT  (via drill 0.61)
  Top 0.254: IC1.20 19.46,37.54 23,34 23,12 24,11 51,11 52,12 | IC2.20 51.46,37.54 52,37 52,12 | v132,10 124,10 122,12 | 52,12 53.01,10.99 69.49,10.99 71,12.5 75,12.5 76.5,11 92,11 93,12 | IC4.20 121.46,37.54 122,37 122,12 | 122,12 121,11 94,11 93,12 | IC3.20 89.46,37.54 93,34 93,12
  Bottom 0.254: J3.6 141,24.3 141,11 140,10 v132,10
ADDR2  (via drill 0.61)
  Top 0.254: R67.2 3.76,32.76 5.24,34.24 SJ1.1 5.24,40.24 8,43 14,43 15.65,41.35 IC1.17 19.35,41.35 v19.5,41.5 | IC4.17 121.35,41.35 v121.5,41.5 | v90,41.5 89.85,41.35 IC3.17 | IC2.17 51.35,41.35 v51.5,41.5
  Bottom 0.254: v121.5,41.5 120.56,42.44 97.94,42.44 95,39.5 92,39.5 v90,41.5 89.5,42 78.5,42 76.5,40 53,40 v51.5,41.5 50.56,42.44 27.44,42.44 25,40 21,40 v19.5,41.5
GND  (via drill 0.61)
  Bottom 0.254: J2.G7 118.16,9.16 v117,8 | J2.E7 90.22,9.78 v92,8 | J1.G7 48.16,9.16 v47,8
  pour Top (rank 2): 143,0 arc90 146,3 146,47 arc90 143,50 3,50 arc90 0,47 0,3 arc90 3,0
GPA0-1
  Top 0.254: IC1.21 16.49,36.27 R1.1
GPA0-2
  Top 0.254: IC2.21 48.49,36.27 R17.1
GPA0-3
  Top 0.254: IC3.21 86.49,36.27 R33.1
GPA0-4
  Top 0.254: IC4.21 118.49,36.27 R51.1
GPA1-1
  Top 0.254: IC1.22 15.76,35 R3.1
GPA1-2
  Top 0.254: IC2.22 47.76,35 R19.1
GPA1-3
  Top 0.254: IC3.22 85.76,35 R35.1
GPA1-4
  Top 0.254: IC4.22 117.76,35 R53.1
GPA2-1
  Top 0.254: IC1.23 15.03,33.73 R2.1
GPA2-2
  Top 0.254: IC2.23 47.03,33.73 R18.1
GPA2-3
  Top 0.254: IC3.23 85.03,33.73 R34.1
GPA2-4
  Top 0.254: IC4.23 117.03,33.73 R52.1
GPA3-1
  Top 0.254: R4.1 14.3,32.46 IC1.24
GPA3-2
  Top 0.254: R20.1 46.3,32.46 IC2.24
GPA3-3
  Top 0.254: IC3.24 84.3,32.46 R36.1
GPA3-4
  Top 0.254: IC4.24 116.3,32.46 R54.1
GPA4-1
  Top 0.254: R7.1 13.57,31.19 IC1.25
GPA4-2
  Top 0.254: R23.1 45.57,31.19 IC2.25
GPA4-3
  Top 0.254: IC3.25 83.57,31.19 R41.1
GPA4-4
  Top 0.254: IC4.25 115.57,31.19 R57.1
GPA5-1
  Top 0.254: IC1.26 12.84,29.92 R6.1
GPA5-2
  Top 0.254: IC2.26 44.84,29.92 R22.1
GPA5-3
  Top 0.254: IC3.26 82.84,29.92 R38.1
GPA5-4
  Top 0.254: IC4.26 114.84,29.92 R56.1
GPA6-1
  Top 0.254: IC1.27 13.41,28.65 R5.1
GPA6-2
  Top 0.254: IC2.27 45.41,28.65 R21.1
GPA6-3
  Top 0.254: IC3.27 83.41,28.65 R37.1
GPA6-4
  Top 0.254: IC4.27 115.41,28.65 R55.1
GPA7-1
  Top 0.254: IC1.28 14.14,27.38 R8.1
GPA7-2
  Top 0.254: IC2.28 46.14,27.38 R24.1
GPA7-3
  Top 0.254: IC3.28 84.14,27.38 R42.1
GPA7-4
  Top 0.254: IC4.28 116.14,27.38 R58.1
GPB0-1
  Top 0.254: IC1.1 29.86,27.38 R15.1
GPB0-2
  Top 0.254: IC2.1 61.86,27.38 R31.1
GPB0-3
  Top 0.254: IC3.1 99.86,27.38 R49.1
GPB0-4
  Top 0.254: IC4.1 131.86,27.38 R65.1
GPB1-1
  Top 0.254: IC1.2 30.59,28.65 R13.1
GPB1-2
  Top 0.254: IC2.2 62.59,28.65 R29.1
GPB1-3
  Top 0.254: IC3.2 100.59,28.65 R47.1
GPB1-4
  Top 0.254: IC4.2 132.59,28.65 R63.1
GPB2-1
  Top 0.254: R11.1 31.16,29.92 IC1.3
GPB2-2
  Top 0.254: R27.1 63.16,29.92 IC2.3
GPB2-3
  Top 0.254: IC3.3 101.16,29.92 R45.1
GPB2-4
  Top 0.254: IC4.3 133.16,29.92 R61.1
GPB3-1
  Top 0.254: R9.1 30.43,31.19 IC1.4
GPB3-2
  Top 0.254: R25.1 62.43,31.19 IC2.4
GPB3-3
  Top 0.254: IC3.4 100.43,31.19 R43.1
GPB3-4
  Top 0.254: IC4.4 132.43,31.19 R59.1
GPB4-1
  Top 0.254: R16.1 29.7,32.46 IC1.5
GPB4-2
  Top 0.254: R32.1 61.7,32.46 IC2.5
GPB4-3
  Top 0.254: IC3.5 99.7,32.46 R50.1
GPB4-4
  Top 0.254: IC4.5 131.7,32.46 R66.1
GPB5-1
  Top 0.254: IC1.6 28.97,33.73 R14.1
GPB5-2
  Top 0.254: IC2.6 60.97,33.73 R30.1
GPB5-3
  Top 0.254: IC3.6 98.97,33.73 R48.1
GPB5-4
  Top 0.254: IC4.6 130.97,33.73 R64.1
GPB6-1
  Top 0.254: IC1.7 28.24,35 R12.1
GPB6-2
  Top 0.254: IC2.7 60.24,35 R28.1
GPB6-3
  Top 0.254: IC3.7 98.24,35 R46.1
GPB6-4
  Top 0.254: IC4.7 130.24,35 R62.1
GPB7-1
  Top 0.254: IC1.8 27.51,36.27 R10.1
GPB7-2
  Top 0.254: IC2.8 59.51,36.27 R26.1
GPB7-3
  Top 0.254: IC3.8 97.51,36.27 R44.1
GPB7-4
  Top 0.254: IC4.8 130.27,36.27 132,38 132,39.5 132.5,40 R60.1
N$1
  Top 0.254: SJ2.1 132,48.26 R68.2
N$2
  Top 0.254: SJ3.1 136,48.26 R69.2
N$7
  Top 0.254: R39.1 LED1.A
N$8
  Top 0.254: LED2.A R40.1
SCL  (via drill 0.61)
  Top 0.254: J3.2 142.54,37.46 137,43 131,43 129.35,41.35 IC4.12 126.35,41.35 v126,41 | v94,41 94.35,41.35 IC3.12 | v56,41 56.35,41.35 IC2.12 | IC1.12 24.35,41.35 v24,41 | R68.1 128.24,46.74 v128,46.5
  Bottom 0.254: v24,41 26,43 54,43 v56,41 76.5,41 78.5,43 92,43 v94,41 96,43 124,43 v126,41 128,43 v128,46.5
SDA  (via drill 0.61)
  Top 0.254: J3.1 141,40 137,44 131,44 129.62,42.62 IC4.13 126.38,42.62 v126,43 | v94,43 94.38,42.62 IC3.13 | v56,43 56.38,42.62 IC2.13 | IC1.13 24.38,42.62 v24,43 | R69.1 v138.5,45
  Bottom 0.254: v126,43 125,44 95,44 v94,43 93,44 78,44 76,42 57,42 v56,43 55,44 25,44 v24,43 | v138.5,45 138.5,43 141.5,40 J3.1
VCC  (via drill 0.61)
  Top 0.254: IC4.15 IC4.16 | IC4.18 117.92,40.08 | 97.54,37.54 IC3.9 | 17.3,40 IC1.18 14.92,40.08 13,42 9,42 6.76,39.76 SJ1.2 | 59.54,37.54 IC2.9 | SJ2.2 132.74,46 v134,46 135.26,46 SJ3.2 | R39.2 141,31.92 J3.3
  Top 0.406: 51.92,40.08 IC2.18 46.92,40.08 45,42 37.5,42 33.6,45.9 C1.1 22.9,45.9 21,44 21,40 | IC3.9 94.46,37.54 91.92,40.08 | 91.92,40.08 IC3.18 84.92,40.08 83,42 78,42 77,41 69,41 68,42 63,42 | 123,40.08 123.92,40.08 126.46,37.54 IC4.9 130.04,37.54 131,38.5 131,40 132,41 137,41 143.08,34.92 J3.3 | 123,40.08 IC4.18 | IC2.15 51.99,43.89 52.92,42.96 52.92,41.08 51.92,40.08 | IC3.16 90.62,42.62 91.92,41.32 91.92,40.08 | 120.99,43.89 IC4.15 | 117.92,40.08 116,42 101,42 | 101,42 100,41 100,40 97.54,37.54 | 123,40.08 123,41.88 120.99,43.89 | 21,40 23.46,37.54 IC1.9 | 21,40 17.3,40 | 63,42 62,41 62,40 59.54,37.54 | IC2.9 54.46,37.54 51.92,40.08 | 63,42 62,43 C2.1 | C3.1 100,43 101,42 | C4.1 122.6,45.5 120.99,43.89
  Bottom 0.254: v134,46 134,45 136,43 136,42.92 J3.3
VIN  (via drill 0.61)
  Top 0.254: R40.2 v144,23
  other vias: 72.5,20 73.5,20 72.5,14.5 73.5,14.5
  pour Bottom: 143,0 arc90 146,3 146,47 arc90 143,50 3,50 arc90 0,47 0,3 arc90 3,0
  pour Top (isolate 0.25): 72,20.5 72,14 74,14 74,20.5

### Text on the board
tPlace: www.superhouse.tv/i2crj45x16 | 16 Channel I2C RJ45 Breakout | 0x20/24 | SKU: I2CRJ45X16 | 0x21/25 | 0x22/26 | by Jon Oxer | 0x23/27 | I2C P/U | I2C Addr | SDA | SCL | Open: / 0x20-23 | VCC | GND | Closed: / 0x24-27 | VIN | Super / House | !INT | MCP23017 | MCP23017 | MCP23017 | MCP23017 | VCC | VIN | VCC: 1.8-5.5V | VIN: 12V | v1.0
bPlace: RJ45 Pinout: | Copyright 2019 SuperHouse Automation Pty Ltd / / Released under the terms / of the TAPR Open Hardware / License: www.tapr.org/OHL | 1: Data 1 / 2: Data 2 / 3: Data 3 / 4: VIN / 5: VIN / 6: Data 4 / 7: GND / 8: GND | 1K in series with each data line